# Altium schematic sheet Auto Terrarium.SchDoc
size A
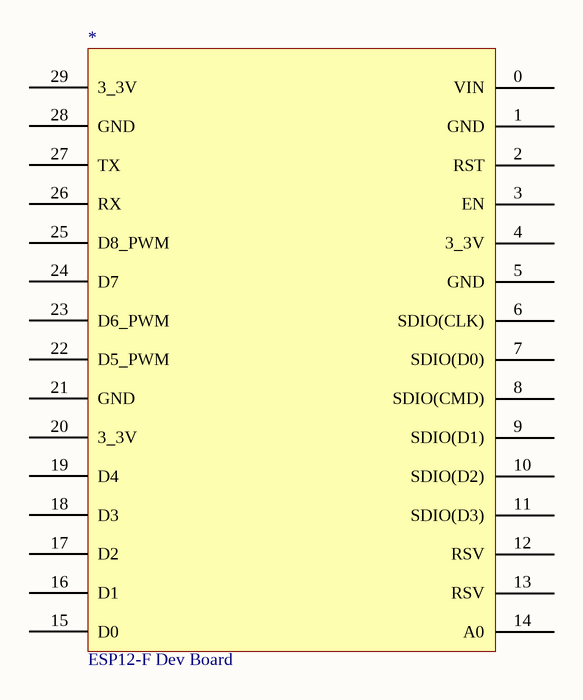
[diagram p0: Auto Terrarium.SchDoc]

## Parts
*  ESP12-F Dev Board  [PCB-z8aaw0yugxv87lcq77q0-1]

## Nets

Not connected (* = marked no-connect by the designer): * 0(VIN) 1(GND) 2(RST) 3(EN) 4(3_3V) 5(GND) 6(SDIO(CLK)) 7(SDIO(D0)) 8(SDIO(CMD)) 9(SDIO(D1)) 10(SDIO(D2)) 11(SDIO(D3)) 12(RSV) 13(RSV) 14(A0) 15(D0) 16(D1) 17(D2) 18(D3) 19(D4) 20(3_3V) 21(GND) 22(D5_PWM) 23(D6_PWM) 24(D7) 25(D8_PWM) 26(RX) 27(TX) 28(GND) 29(3_3V)

## Library data of the parts
* = CMP-sxw3ufcwmxs35hbw3bea-1: Board for the ESP12-F module made by Doit.am; CustomComponentID: sxw3ufcwmxs35hbw3bea